# EAGLE design untitled (EAGLE 7.4.0)
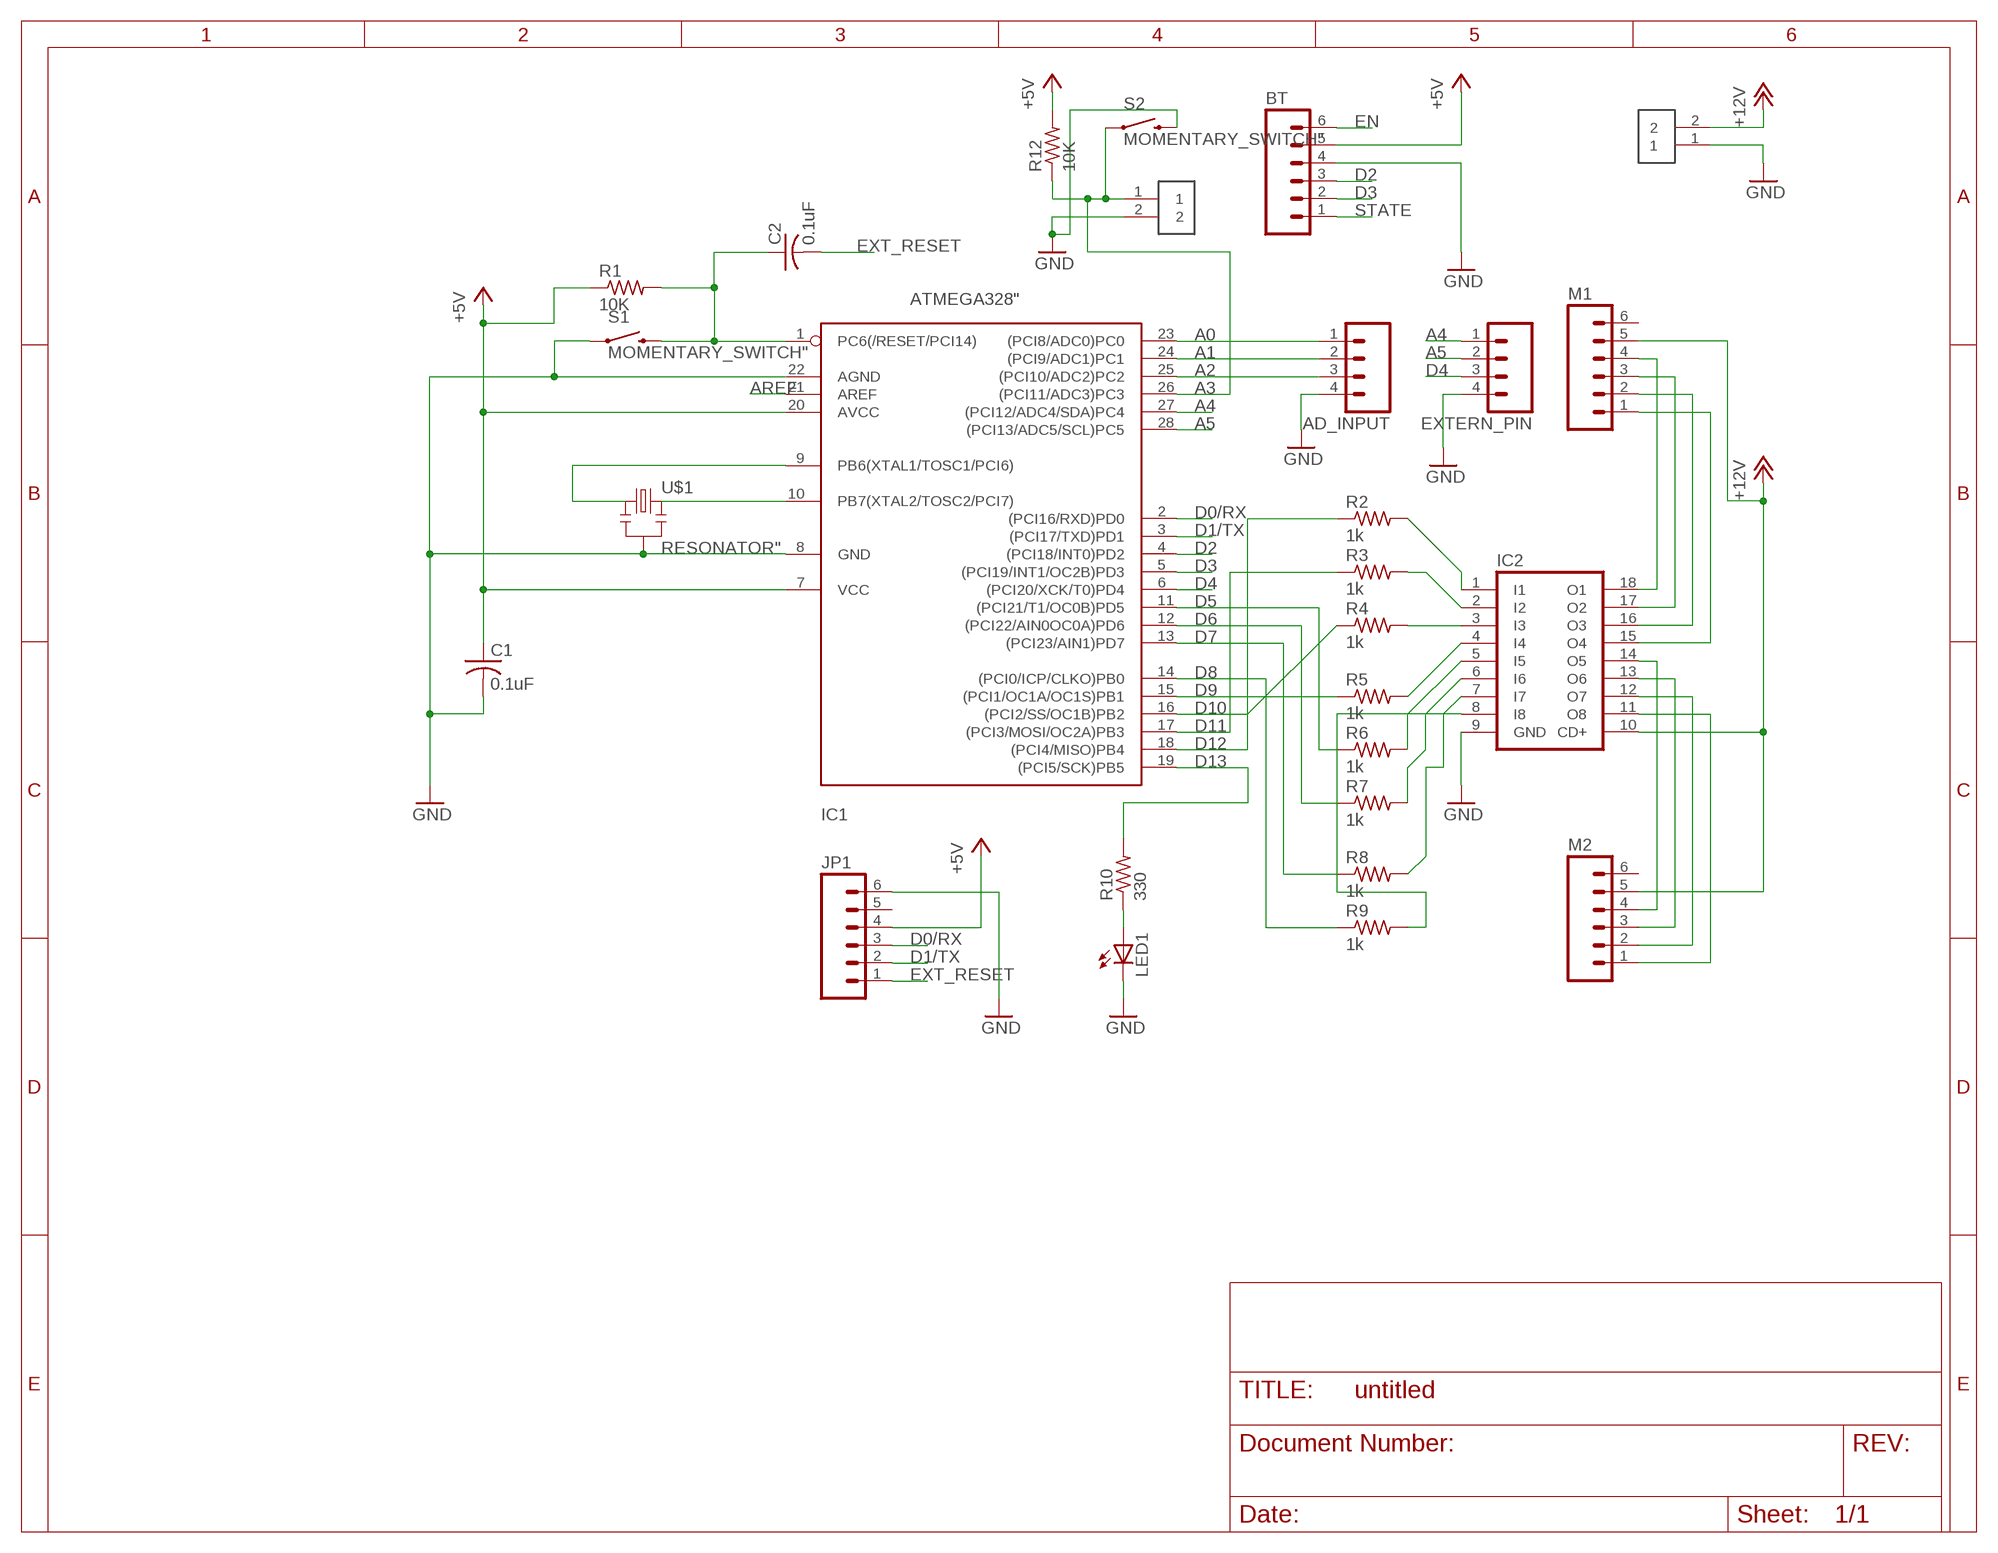
[diagram p0: schematic, sheet 1]

## Parts
12V_INPUT  1X02_HEADER  [1X02_HEADER]
AD_INPUT  1X04_HEADER"  [1X04_HEADER]
BT  1X06_HEADER"  [1X06_HEADER]
C1  0.1uF  UNPOLARIZED_CAP"  [UNPOLARIZED_CAP]
C2  0.1uF  UNPOLARIZED_CAP"  [UNPOLARIZED_CAP]
EXTERN_PIN  1X04_HEADER"  [1X04_HEADER]
IC1  ATMEGA328"  [ATMEGA328]
IC2  ULN2803A  [DIL18]
JP1  1X06_HEADER"  [1X06_HEADER]
LED1  LED3MM  [LED]
LIMIT_SW  1X02_HEADER  [1X02_HEADER]
M1  1X06_HEADER"  [1X06_HEADER]
M2  1X06_HEADER"  [1X06_HEADER]
R1  10K  RESISTOR1/6WATT  [RESISTOR]
R2  1k  RESISTOR1/6WATT  [RESISTOR]
R3  1k  RESISTOR1/6WATT  [RESISTOR]
R4  1k  RESISTOR1/6WATT  [RESISTOR]
R5  1k  RESISTOR1/6WATT  [RESISTOR]
R6  1k  RESISTOR1/6WATT  [RESISTOR]
R7  1k  RESISTOR1/6WATT  [RESISTOR]
R8  1k  RESISTOR1/6WATT  [RESISTOR]
R9  1k  RESISTOR1/6WATT  [RESISTOR]
R10  330  RESISTOR1/6WATT  [RESISTOR]
R12  10K  RESISTOR1/6WATT  [RESISTOR]
S1  MOMENTARY_SWITCH"  [MOMENTARY_SWITCH]
S2  MOMENTARY_SWITCH"  [MOMENTARY_SWITCH]
U$1  RESONATOR"  [RESONATOR]

## Nets
+5V: BT.5 C1.1 IC1.7(VCC) IC1.20(AVCC) JP1.4 R1.1 R12.2
+12V: 12V_INPUT.2 IC2.10(CD+) M1.5 M2.5
A0: AD_INPUT.1 IC1.23((PCI8/ADC0)PC0)
A1: AD_INPUT.2 IC1.24((PCI9/ADC1)PC1)
A2: AD_INPUT.3 IC1.25((PCI10/ADC2)PC2)
A3: IC1.26((PCI11/ADC3)PC3) LIMIT_SW.1 R12.1 S2.1
A4: EXTERN_PIN.1 IC1.27((PCI12/ADC4/SDA)PC4)
A5: EXTERN_PIN.2 IC1.28((PCI13/ADC5/SCL)PC5)
AREF: IC1.21(AREF)
D0/RX: IC1.2((PCI16/RXD)PD0) JP1.3
D1/TX: IC1.3((PCI17/TXD)PD1) JP1.2
D2: BT.3 IC1.4((PCI18/INT0)PD2)
D3: BT.2 IC1.5((PCI19/INT1/OC2B)PD3)
D4: EXTERN_PIN.3 IC1.6((PCI20/XCK/T0)PD4)
D5: IC1.11((PCI21/T1/OC0B)PD5) R6.1
D6: IC1.12((PCI22/AIN0OC0A)PD6) R7.1
D7: IC1.13((PCI23/AIN1)PD7) R8.1
D8: IC1.14((PCI0/ICP/CLKO)PB0) R9.1
D9: IC1.15((PCI1/OC1A/OC1S)PB1) R5.1
D10: IC1.16((PCI2/SS/OC1B)PB2) R4.1
D11: IC1.17((PCI3/MOSI/OC2A)PB3) R3.1
D12: IC1.18((PCI4/MISO)PB4) R2.1
D13: IC1.19((PCI5/SCK)PB5) R10.2
EN: BT.6
EXT_RESET: C2.2 JP1.1
GND: 12V_INPUT.1 AD_INPUT.4 BT.4 C1.2 EXTERN_PIN.4 IC1.8(GND) IC1.22(AGND) IC2.9(GND) JP1.6 LED1.K(C) LIMIT_SW.2 S1.1 S2.3 U$1.2
N$1: IC1.9(PB6(XTAL1/TOSC1/PCI6)) U$1.1
N$2: IC1.10(PB7(XTAL2/TOSC2/PCI7)) U$1.3
N$3: C2.1 IC1.1(PC6(/RESET/PCI14)) R1.2 S1.3
N$4: IC2.1(I1) R2.2
N$5: IC2.2(I2) R3.2
N$6: IC2.3(I3) R4.2
N$7: IC2.4(I4) R5.2
N$8: IC2.5(I5) R6.2
N$9: IC2.6(I6) R7.2
N$10: IC2.7(I7) R8.2
N$11: IC2.8(I8) R9.2
N$12: IC2.18(O1) M1.4
N$13: IC2.17(O2) M1.3
N$14: IC2.16(O3) M1.2
N$15: IC2.15(O4) M1.1
N$16: IC2.14(O5) M2.4
N$17: IC2.13(O6) M2.3
N$18: IC2.12(O7) M2.2
N$19: IC2.11(O8) M2.1
N$20: LED1.A R10.1
STATE: BT.1
Unconnected: JP1.5 M1.6 M2.6

## Library data of the parts
12V_INPUT LIMIT_SW = RBBB:1X02_HEADER
AD_INPUT EXTERN_PIN = RBBB:1X04_HEADER: Header 4 Standard 4-pin 0.1" header. Use with straight break away headers (SKU : PRT-00116), right angle break away headers (PRT-00553), swiss pins (PRT-00743), machine pins (PRT-00117), and female headers (PRT-00115). Molex polarized connector foot print use with SKU : PRT-08231 with associated crimp pins and housings.
BT JP1 M1 M2 = RBBB:1X06_HEADER
C1 C2 = RBBB:UNPOLARIZED_CAP: CAPACITOR, American symbol
IC1 = RBBB:ATMEGA328: MICROCONTROLLER 16 kBytes FLASH 1 kBytes SRAM 512 Bytes EEPROM USART 8-channel 10 bit ADC
IC2 = uln-udn:ULN2803A: DRIVER ARRAY
LED1 = RBBB:LED: LED OSRAM: - CHIPLED LG R971, LG N971, LY N971, LG Q971, LY Q971, LO R971, LY R971 LH N974, LH R974 LS Q976, LO Q976, LY Q976 LO Q996 - Hyper CHIPLED LW Q18S LB Q993, LB Q99A, LB R99A - SideLED LS A670, LO A670, LY A670, LG A670, LP A670 LB A673, LV A673, LT A673, LW A673 LH A674 LY A675 LS A676, LA A676, LO A676, LY A676, LW A676 LS A679, LY A679, LG A679 - Hyper Micro SIDELED® LS Y876, LA Y876, LO Y876, LY Y876 LT Y87S - SmartLED LW L88C, LW L88S LB L89C, LB L89S, LG L890 LS L89K, LO L89K, LY L89K LS L896, LA L896, LO L896, LY L896 - TOPLED LS T670, LO T670, LY T670, LG T670, LP T670 LSG T670, LSP T670, LSY T670, LOP T670, LYG T670 LG T671, LOG T671, LSG T671 LB T673, LV T673, LT T673, LW T673 LH T674 LS T676, LA T676, LO T676, LY T676, LB T676, LH T676, LSB T676, LW T676 LB T67C, LV T67C, LT T67C, LS T67K, LO T67K, LY T67K, LW E67C LS E67B, LA E67B, LO E67B, LY E67B, LB E67C, LV E67C, LT E67C LW T67C LS T679, LY T679, LG T679 LS T770, LO T770, LY T770, LG T770, LP T770 LB T773, LV T773, LT T773, LW T773 LH T774 LS E675, LA E675, LY E675, LS T675 LS T776, LA T776, LO T776, LY T776, LB T776 LHGB T686 LT T68C, LB T68C - Hyper Mini TOPLED® LB M676 - Mini TOPLED Santana® LG M470 LS M47K, LO M47K, LY M47K Source: http://www.osram.convergy.de LUXEON: - LUMILED® LXK2-PW12-R00, LXK2-PW12-S00, LXK2-PW14-U00, LXK2-PW14-V00 LXK2-PM12-R00, LXK2-PM12-S00, LXK2-PM14-U00 LXK2-PE12-Q00, LXK2-PE12-R00, LXK2-PE12-S00, LXK2-PE14-T00, LXK2-PE14-U00 LXK2-PB12-K00, LXK2-PB12-L00, LXK2-PB12-M00, LXK2-PB14-N00, LXK2-PB14-P00, LXK2-PB14-Q00 LXK2-PR12-L00, LXK2-PR12-M00, LXK2-PR14-Q00, LXK2-PR14-R00 LXK2-PD12-Q00, LXK2-PD12-R00, LXK2-PD12-S00 LXK2-PH12-R00, LXK2-PH12-S00 LXK2-PL12-P00, LXK2-PL12-Q00, LXK2-PL12-R00 Source: www.luxeon.com KINGBRIGHT: KA-3528ASYC Source: www.kingbright.com
R1-R10 R12 = RBBB:RESISTOR: RESISTOR, American symbol
S1 S2 = RBBB:MOMENTARY_SWITCH
U$1 = RBBB:RESONATOR: Resonator Small SMD resonator. This is the itty bitty 10/20MHz resonators with built in caps. CSTCE10M0G55 and CSTCE20M0V53. Footprint has been reviewed closely but hasn t been tested yet.'

## Board
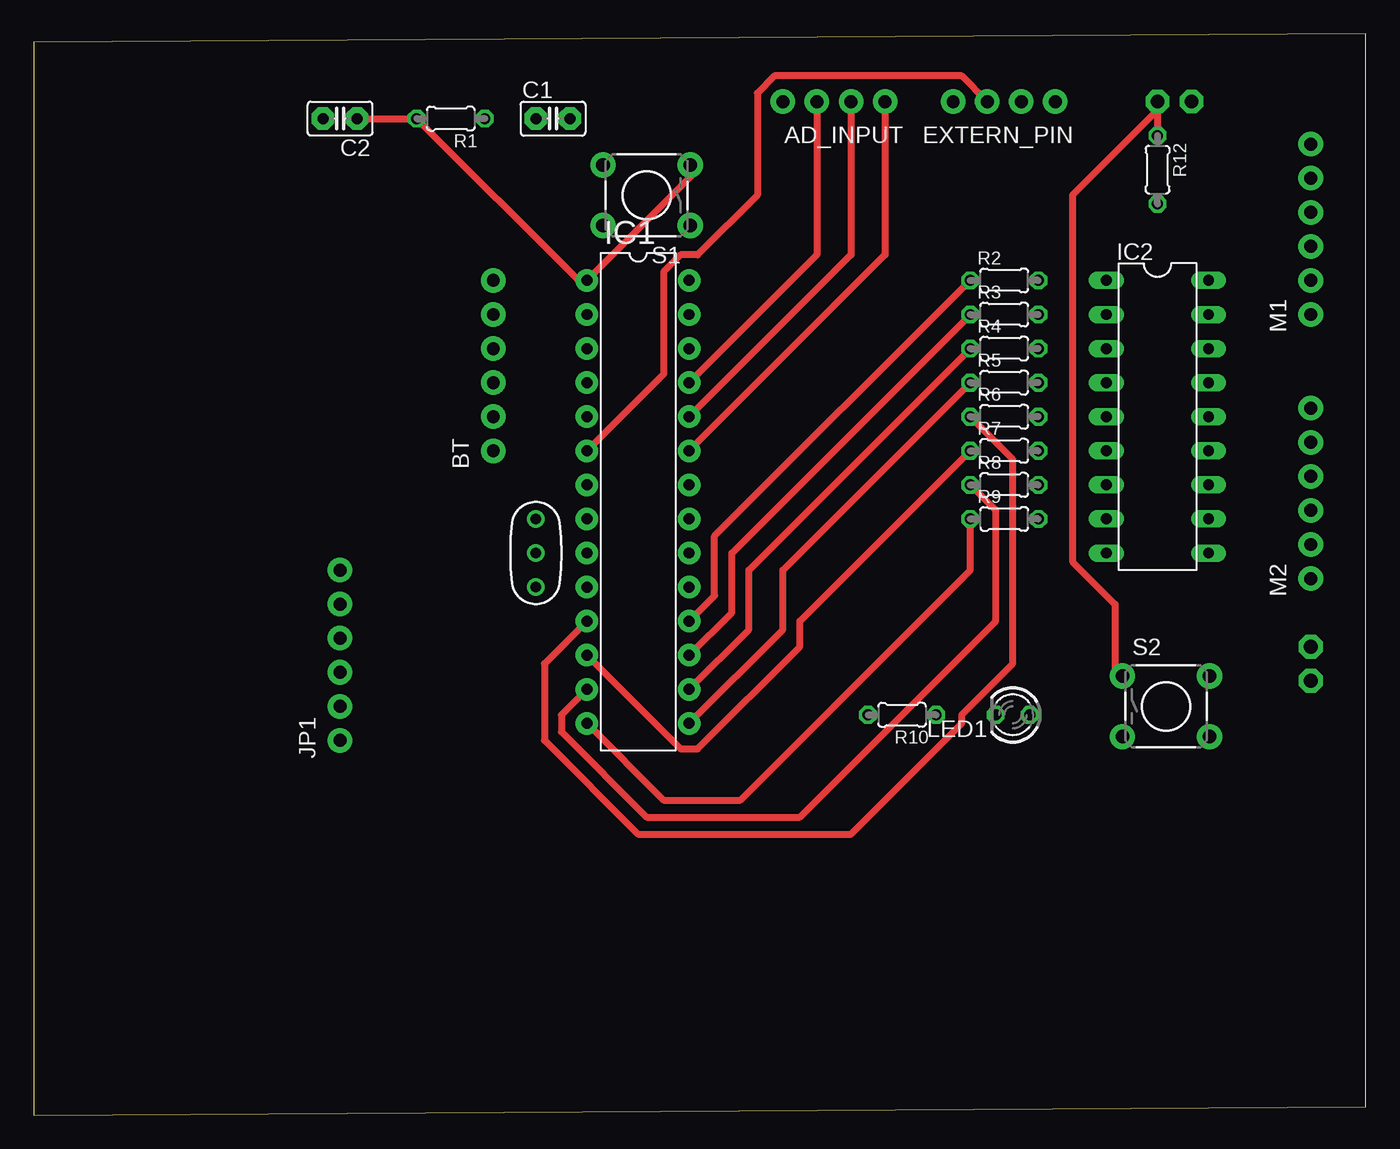
[diagram p1: board, top side]
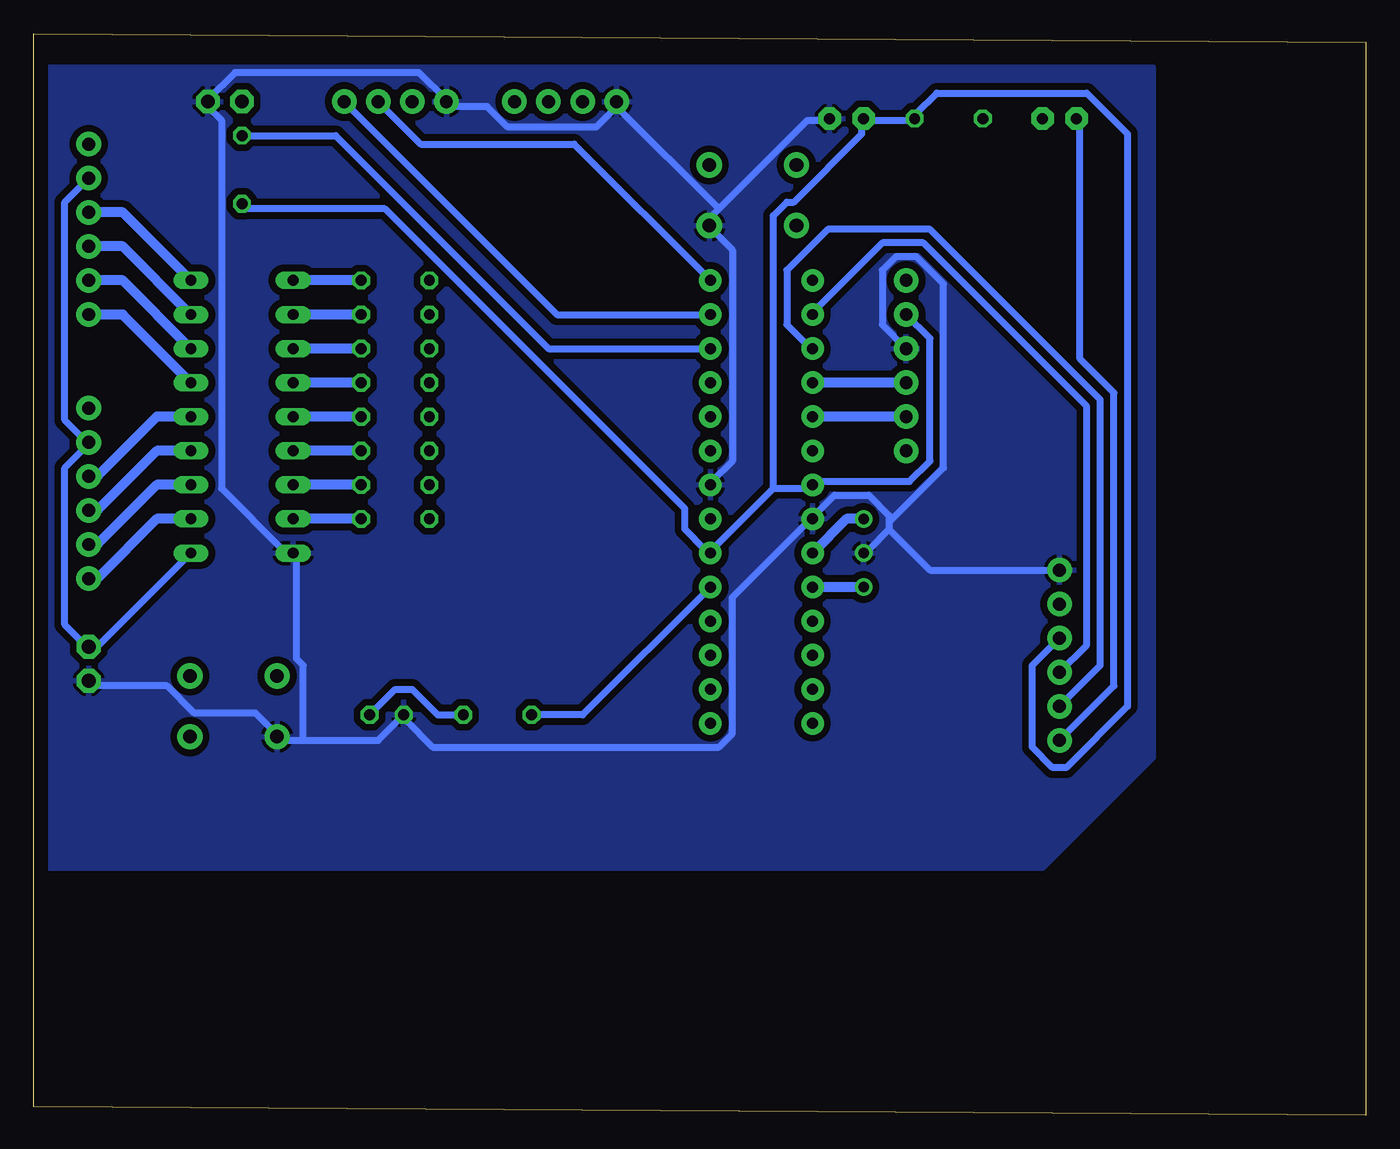
[diagram p2: board, bottom side, seen from below]

Size 99.36 x 80.64 mm. Coordinates in mm from the lower left corner, seen from the top.
Outline: 0,0 99.36,0.64 99.36,80.64 0,80 0,0
Copper layers (1*16): Top 0.035mm / dielectric 1.5mm / Bottom 0.035mm
Design rules "default *": minimum track width 20mil, minimum drill 24mil, track to track 20mil, track to pad 20mil, pad to pad 20mil, via to via 20mil, smd to smd 8mil, copper to edge 40mil, drill to drill 8mil, minimum pad ring 10mil, minimum via ring 8mil, stop-mask expansion 4mil, vias tented up to drill 0mil, thermal gap 10mil

### Footprints (pad centres in the part's own frame; a part is rotated, then mirrored left to right if it is on the bottom)
1X02_HEADER = drill 1.016 pad 1.778 octagon: 1 -1.27,0; 2 1.27,0
1X04_HEADER = drill 0.965 pad 1.829: 1 0,0; 2 2.54,0; 3 5.08,0; 4 7.62,0
1X06_HEADER = drill 0.965 pad 1.829: 1 0,0; 2 2.54,0; 3 5.08,0; 4 7.62,0; 5 10.16,0; 6 12.7,0
UNPOLARIZED_CAP = drill 0.813 pad 1.676 octagon: 1 -1.27,0; 2 1.27,0
ATMEGA328 = drill 0.813 pad 1.676: 1 -16.51,-3.81; 2 -13.97,-3.81; 3 -11.43,-3.81; 4 -8.89,-3.81; 5 -6.35,-3.81; 6 -3.81,-3.81; 7 -1.27,-3.81; 8 1.27,-3.81; 9 3.81,-3.81; 10 6.35,-3.81; 11 8.89,-3.81; 12 11.43,-3.81; 13 13.97,-3.81; 14 16.51,-3.81; 15 16.51,3.81; 16 13.97,3.81; 17 11.43,3.81; 18 8.89,3.81; 19 6.35,3.81; 20 3.81,3.81; 21 1.27,3.81; 22 -1.27,3.81; 23 -3.81,3.81; 24 -6.35,3.81; 25 -8.89,3.81; 26 -11.43,3.81; 27 -13.97,3.81; 28 -16.51,3.81
DIL18 = drill 0.813 long: 1 -10.16,-3.81; 2 -7.62,-3.81; 3 -5.08,-3.81; 4 -2.54,-3.81; 5 0,-3.81; 6 2.54,-3.81; 7 5.08,-3.81; 8 7.62,-3.81; 9 10.16,-3.81; 10 10.16,3.81; 11 7.62,3.81; 12 5.08,3.81; 13 2.54,3.81; 14 0,3.81; 15 -2.54,3.81; 16 -5.08,3.81; 17 -7.62,3.81; 18 -10.16,3.81
LED = drill 0.813 octagon: A -1.27,0; K 1.27,0
RESISTOR = drill 0.813 octagon: 1 -2.54,0; 2 2.54,0
MOMENTARY_SWITCH = drill 1.016 pad 1.88: 1 -3.251,2.261; 2 3.251,2.261; 3 -3.251,-2.261; 4 3.251,-2.261
RESONATOR = drill 0.8: 1 -2.54,0; 2 0,0; 3 2.54,0

### Placement (x,y rotation side)
12V_INPUT  95.25,33.66 90 top
AD_INPUT  63.5,75.56 180 top
BT  34.29,49.53 90 top
C1  38.73,74.3 0 top
C2  22.86,74.3 180 top
EXTERN_PIN  76.2,75.56 180 top
IC1  45.09,45.72 270 top
IC2  83.82,52.07 270 top
JP1  22.86,27.94 90 top
LED1  73.03,29.84 180 top
LIMIT_SW  85.09,75.56 0 top
M1  95.25,59.69 90 top
M2  95.25,40.01 90 top
R1  31.11,74.3 180 top
R2  72.39,62.23 0 top
R3  72.39,59.69 0 top
R4  72.39,57.15 0 top
R5  72.39,54.61 0 top
R6  72.39,52.07 0 top
R7  72.39,49.53 0 top
R8  72.39,46.99 0 top
R9  72.39,44.45 0 top
R10  64.77,29.84 180 top
R12  83.82,70.48 270 top
S1  45.72,68.58 180 top
S2  84.45,30.48 0 top
U$1  37.47,41.91 270 top

### Tracks (layer width: path | path; a pad name or v marks a point on that pad's centre or on a via)
+5V
  Bottom 0.508: JP1.4 24.89,33.53 24.89,27.43 23.37,25.91 22.35,25.91 17.78,30.48 17.78,73.15 20.83,76.2 32,76.2 33.53,74.68 R1.1 34.04,74.17 37.08,74.17 C1.1 37.59,74.17 37.59,73.15 42.67,68.07 43.18,68.07 44.2,67.06 44.2,46.74 | R12.2 83.82,67.56 73.15,67.56 50.8,45.21 50.8,43.69 49.28,42.16 IC1.20 48.77,42.16 44.2,46.74 | 44.2,46.74 41.66,46.74 IC1.7 41.15,47.24 34.04,47.24 32.51,48.77 32.51,57.91 BT.5
+12V
  Bottom 0.508: IC2.10 95,34.54 12V_INPUT.2 95.5,35.05 97.03,36.58 97.03,48.26 95.5,49.78 M2.5 95.5,50.29 97.03,51.82 97.03,68.07 M1.5
A0
  Top 0.508: IC1.23 63.5,64.14 AD_INPUT.1
A1
  Top 0.508: IC1.24 60.96,64.14 AD_INPUT.2
A2
  Top 0.508: IC1.25 58.42,64.14 AD_INPUT.3
A3
  Top 0.508: 83.82,74.93 R12.1 | 83.82,74.93 77.47,68.58 77.47,41.27 80.64,38.1 80.64,33.02 S2.1 | 83.82,74.93 LIMIT_SW.1
  Bottom 0.508: IC1.26 60.96,57.15 76.83,73.03 R12.1
A4
  Bottom 0.508: IC1.27 60.33,59.69 EXTERN_PIN.1
A5
  Bottom 0.508: IC1.28 59.05,72.39 70.48,72.39 EXTERN_PIN.2
D0/RX
  Bottom 0.508: JP1.3 20.83,35.05 20.83,52.83 33.02,65.02 36.07,65.02 41.15,59.94 IC1.2
D1/TX
  Bottom 0.508: JP1.2 19.81,33.53 19.81,53.34 32.51,66.04 40.13,66.04 43.18,62.99 43.18,58.93 41.66,57.4 IC1.3
D2
  Bottom 0.762: BT.3 IC1.4
D3
  Bottom 0.762: BT.2 IC1.5
D4
  Top 0.508: IC1.6 46.99,55.24 46.99,62.87 48.26,64.14 49.53,64.14 53.98,68.58 53.98,76.2 55.24,77.47 69.22,77.47 EXTERN_PIN.3
D5
  Top 0.508: R6.1 73.03,48.9 73.03,33.66 69.22,29.84 69.22,29.21 60.96,20.95 45.09,20.95 38.1,27.94 38.1,33.66 IC1.11
D6
  Top 0.508: R7.1 57.15,36.83 57.15,34.92 49.53,27.3 48.26,27.3 IC1.12
D7
  Top 0.508: R8.1 71.75,45.09 71.75,36.83 57.15,22.23 45.72,22.23 39.37,28.57 39.37,29.84 IC1.13
D8
  Top 0.508: R9.1 69.85,40.64 52.7,23.5 46.99,23.5 IC1.14
D9
  Top 0.508: R5.1 55.88,40.64 55.88,36.2 IC1.15
D10
  Top 0.508: R4.1 53.34,40.64 53.34,36.2 IC1.16
D11
  Top 0.508: R3.1 52.07,41.91 52.07,37.47 IC1.17
D12
  Top 0.508: R2.1 50.8,43.18 50.8,38.73 IC1.18
D13
  Bottom 0.508: R10.2 58.42,29.84 IC1.19
EXT_RESET
  Bottom 0.508: JP1.1 18.8,32 18.8,53.85 21.34,56.39 21.34,74.17 C2.2
GND
  Bottom 0.508: 35.56,43.69 37.08,42.16 U$1.2 | 35.56,44.2 35.56,44.7 37.08,46.23 39.62,46.23 41.15,44.7 IC1.8 41.66,44.2 47.24,38.61 47.24,28.45 48.26,27.43 69.6,27.43 71.63,29.46 LED1.K 73.66,27.94 79.25,27.94 | 35.56,44.2 35.56,43.69 | JP1.6 32.51,40.64 35.56,43.69 | BT.4 36.07,58.93 36.07,62.99 35.05,64.01 33.53,64.01 31.5,61.98 31.5,48.26 35.56,44.2 | 79.25,27.94 80.77,27.94 S2.3 81.28,28.45 82.8,29.97 87.38,29.97 89.41,32 95,32 12V_INPUT.1 | 79.25,27.94 79.25,33.53 79.76,34.04 79.76,41.66 IC2.9 80.26,42.16 80.77,42.16 85.34,46.74 85.34,74.17 86.36,75.18 LIMIT_SW.2 86.36,75.69 84.33,77.72 70.61,77.72 68.58,75.69 EXTERN_PIN.4 68.58,75.18 65.53,75.18 64.01,73.66 57.4,73.66 55.88,75.18 | IC1.22 48.77,47.24 47.24,48.77 47.24,64.52 48.77,66.04 S1.1 49.28,66.55 48.26,67.56 | 48.26,67.56 41.66,74.17 40.13,74.17 C1.2 | 48.26,67.56 55.88,75.18 | 55.88,75.18 AD_INPUT.4
  pour Bottom: 15.88,78.11 98.42,78.11 98.42,18.41 24.13,18.41 15.88,26.67
N$1
  Bottom 0.762: U$1.1 38.73,44.45 IC1.9
N$2
  Bottom 0.762: U$1.3 IC1.10
N$3
  Top 0.508: C2.1 R1.2 40.64,62.23 IC1.1 49.53,70.48 S1.3
N$4
  Bottom 0.762: R2.2 IC2.1
N$5
  Bottom 0.762: R3.2 IC2.2
N$6
  Bottom 0.762: R4.2 IC2.3
N$7
  Bottom 0.762: R5.2 IC2.4
N$8
  Bottom 0.762: R6.2 IC2.5
N$9
  Bottom 0.762: R7.2 IC2.6
N$10
  Bottom 0.762: R8.2 IC2.7
N$11
  Bottom 0.762: R9.2 IC2.8
N$12
  Bottom 0.762: IC2.18 92.71,67.31 M1.4
N$13
  Bottom 0.762: IC2.17 92.71,64.77 M1.3
N$14
  Bottom 0.762: IC2.16 92.71,62.23 M1.2
N$15
  Bottom 0.762: IC2.15 92.71,59.69 M1.1
N$16
  Bottom 0.762: IC2.14 90.17,52.07 94.61,47.62 M2.4
N$17
  Bottom 0.762: IC2.13 90.17,49.53 94.61,45.09 M2.3
N$18
  Bottom 0.762: IC2.12 90.17,46.99 94.61,42.55 M2.2
N$19
  Bottom 0.762: IC2.11 90.17,44.45 94.61,40.01 M2.1
N$20
  Bottom 0.508: R10.1 69.22,29.84 71.12,31.75 72.39,31.75 LED1.A